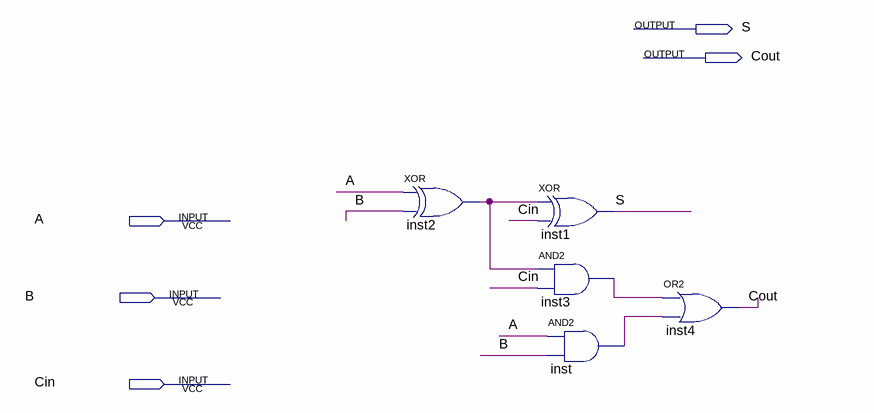
[diagram p0: schematic sheet]
// Quartus schematic FAFINAL.bdf as structural Verilog: 5 symbols, 5 pins
module FAFINAL (
  input  A,
  input  B,
  input  Cin,
  output S,
  output Cout
);

  wire inst2_out, inst3_out, inst_out;

  xor inst2 (inst2_out, A, B);
  xor inst1 (S, inst2_out, Cin);
  and inst3 (inst3_out, inst2_out, Cin);
  and inst (inst_out, A, B);
  or inst4 (Cout, inst3_out, inst_out);
endmodule
